# Altium schematic sheet ICEBoard.SchDoc
size A
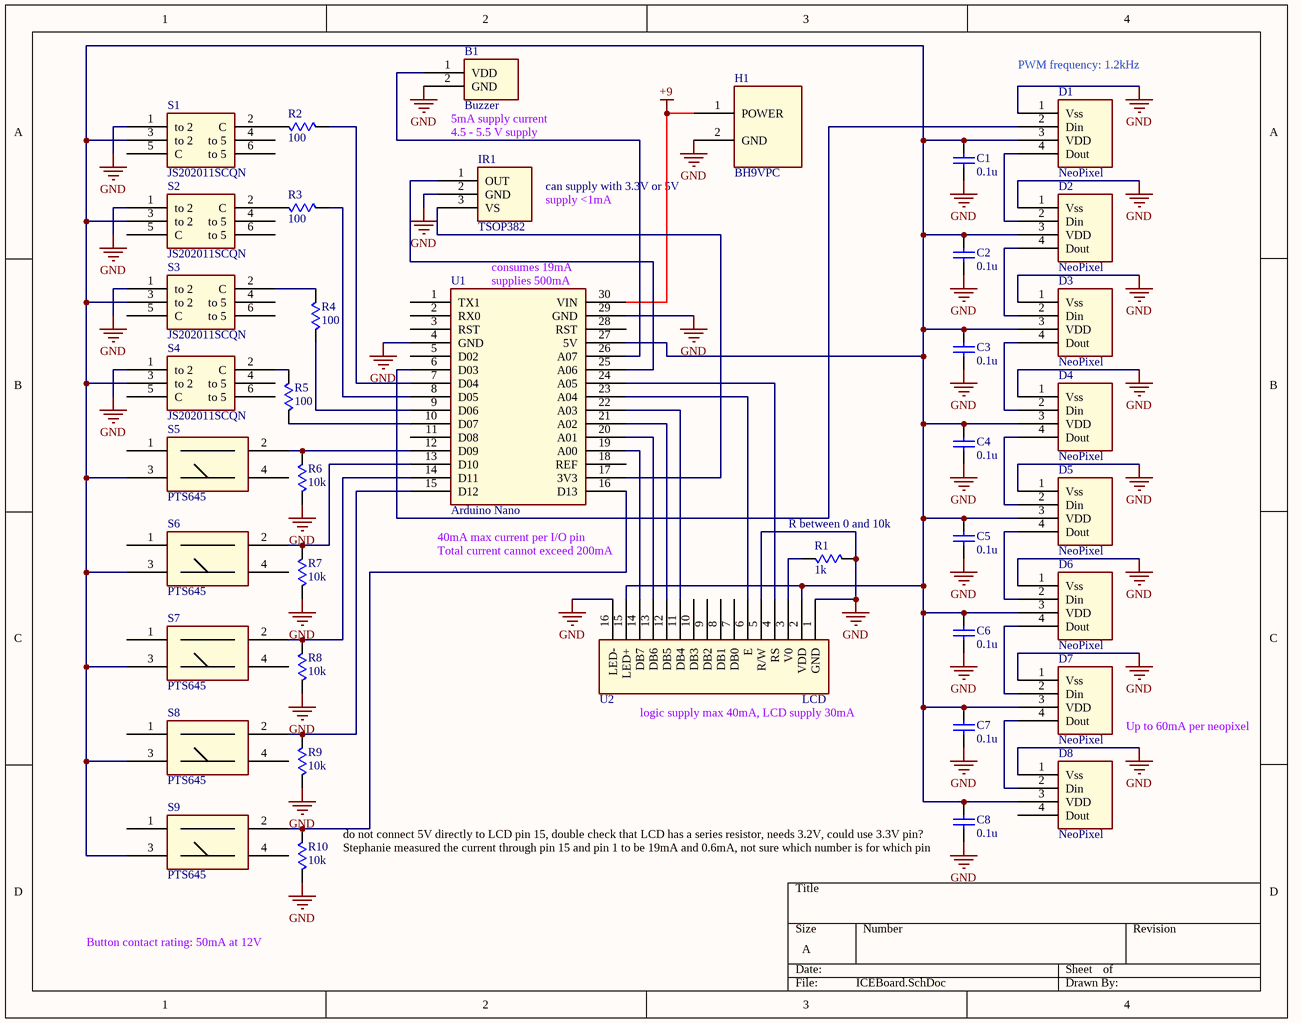
[diagram p0: ICEBoard.SchDoc]

## Parts
B1  Buzzer  [TP124005]
C1  0.1u  [Capacitor]
C2  0.1u  [Capacitor]
C3  0.1u  [Capacitor]
C4  0.1u  [Capacitor]
C5  0.1u  [Capacitor]
C6  0.1u  [Capacitor]
C7  0.1u  [Capacitor]
C8  0.1u  [Capacitor]
D1  NeoPixel  [NeoPixel]
D2  NeoPixel  [NeoPixel]
D3  NeoPixel  [NeoPixel]
D4  NeoPixel  [NeoPixel]
D5  NeoPixel  [NeoPixel]
D6  NeoPixel  [NeoPixel]
D7  NeoPixel  [NeoPixel]
D8  NeoPixel  [NeoPixel]
H1  BH9VPC  [BH9VPC]
IR1  TSOP382  [TSOP382]
R1  1k  [Resistor1608]
R2  100  [Resistor1608]
R3  100  [Resistor1608]
R4  100  [Resistor1608]
R5  100  [Resistor1608]
R6  10k  [Resistor1608]
R7  10k  [Resistor1608]
R8  10k  [Resistor1608]
R9  10k  [Resistor1608]
R10  10k  [Resistor1608]
S1  JS202011SCQN  [JS202011SCQN]
S2  JS202011SCQN  [JS202011SCQN]
S3  JS202011SCQN  [JS202011SCQN]
S4  JS202011SCQN  [JS202011SCQN]
S5  PTS645  [PTS645]
S6  PTS645  [PTS645]
S7  PTS645  [PTS645]
S8  PTS645  [PTS645]
S9  PTS645  [PTS645]
U1  Arduino Nano  [ArduinoNano]
U2  LCD  [TC1602A-01T]

## Nets
+9: H1.1(POWER) U1.30(VIN)
GND: B1.2(GND) C1.2 C2.2 C3.2 C4.2 C5.2 C6.2 C7.2 C8.2 D1.1(Vss) D2.1(Vss) D3.1(Vss) D4.1(Vss) D5.1(Vss) D6.1(Vss) D7.1(Vss) D8.1(Vss) H1.2(GND) IR1.2(GND) R1.1 R6.1 R7.1 R8.1 R9.1 R10.1 S1.1(to_2) S2.1(to_2) S3.1(to_2) S4.1(to_2) U1.4(GND) U1.29(GND) U2.1(GND) U2.5(R/W) U2.16(LED-)
NetB1_1: B1.1(VDD) U1.26(A07)
NetC1_1: C1.1 C2.1 C3.1 C4.1 C5.1 C6.1 C7.1 C8.1 D1.3(VDD) D2.3(VDD) D3.3(VDD) D4.3(VDD) D5.3(VDD) D6.3(VDD) D7.3(VDD) D8.3(VDD) S1.3(to_2) S2.3(to_2) S3.3(to_2) S4.3(to_2) S5.3 S6.3 S7.3 S8.3 S9.3 U1.27(5V) U2.2(VDD) U2.15(LED+)
NetD1_2: D1.2(Din) U1.6(D03)
NetD1_4: D1.4(Dout) D2.2(Din)
NetD2_4: D2.4(Dout) D3.2(Din)
NetD3_4: D3.4(Dout) D4.2(Din)
NetD4_4: D4.4(Dout) D5.2(Din)
NetD5_4: D5.4(Dout) D6.2(Din)
NetD6_4: D6.4(Dout) D7.2(Din)
NetD7_4: D7.4(Dout) D8.2(Din)
NetIR1_1: IR1.1(OUT) U1.25(A06)
NetIR1_3: IR1.3(VS) U1.17(3V3)
NetR1_2: R1.2 U2.3(V0)
NetR2_1: R2.1 U1.7(D04)
NetR2_2: R2.2 S1.2(C)
NetR3_1: R3.1 U1.8(D05)
NetR3_2: R3.2 S2.2(C)
NetR4_1: R4.1 U1.9(D06)
NetR4_2: R4.2 S3.2(C)
NetR5_1: R5.1 U1.10(D07)
NetR5_2: R5.2 S4.2(C)
NetR6_2: R6.2 S5.2 U1.12(D09)
NetR7_2: R7.2 S6.2 U1.13(D10)
NetR8_2: R8.2 S7.2 U1.14(D11)
NetR9_2: R9.2 S8.2 U1.15(D12)
NetR10_2: R10.2 S9.2 U1.16(D13)
NetU1_19: U1.19(A00) U2.14(DB7)
NetU1_20: U1.20(A01) U2.13(DB6)
NetU1_21: U1.21(A02) U2.12(DB5)
NetU1_22: U1.22(A03) U2.11(DB4)
NetU1_23: U1.23(A04) U2.6(E)
NetU1_24: U1.24(A05) U2.4(RS)

Not connected (* = marked no-connect by the designer): D8 4(Dout); S1 4(to_5) 5(C) 6(to_5); S2 4(to_5) 5(C) 6(to_5); S3 4(to_5) 5(C) 6(to_5); S4 4(to_5) 5(C) 6(to_5); S5 1 4; S6 1 4; S7 1 4; S8 1 4; S9 1 4; U1 1(TX1) 2(RX0) 3(RST) 5(D02) 11(D08) 18(REF) 28(RST); U2 7(DB0) 8(DB1) 9(DB2) 10(DB3)

## Notes on the sheet
- (near D1) PWM frequency: 1.2kHz
- (near B1) 5mA supply current
- 4.5 - 5.5 V supply
- can supply with 3.3V or 5V
- supply <1mA
- (near U1) consumes 19mA
- (near U1) supplies 500mA
- (near U1) 40mA max current per I/O pin
- Total current cannot exceed 200mA
- (near R1) R between 0 and 10k
- logic supply max 40mA, LCD supply 30mA
- Up to 60mA per neopixel
- (near C8) do not connect 5V directly to LCD pin 15, double check that LCD has a series resistor, needs 3.2V, could use 3.3V pin?
- (near C8) Stephanie measured the current through pin 15 and pin 1 to be 19mA and 0.6mA, not sure which number is for which pin
- Button contact rating: 50mA at 12V

## Library data of the parts
B1 = TP124005
C1-C8 = Capacitor
R1-R10 = Resistor
U1 = ArduinoNano
U2 = TC1602A-01T